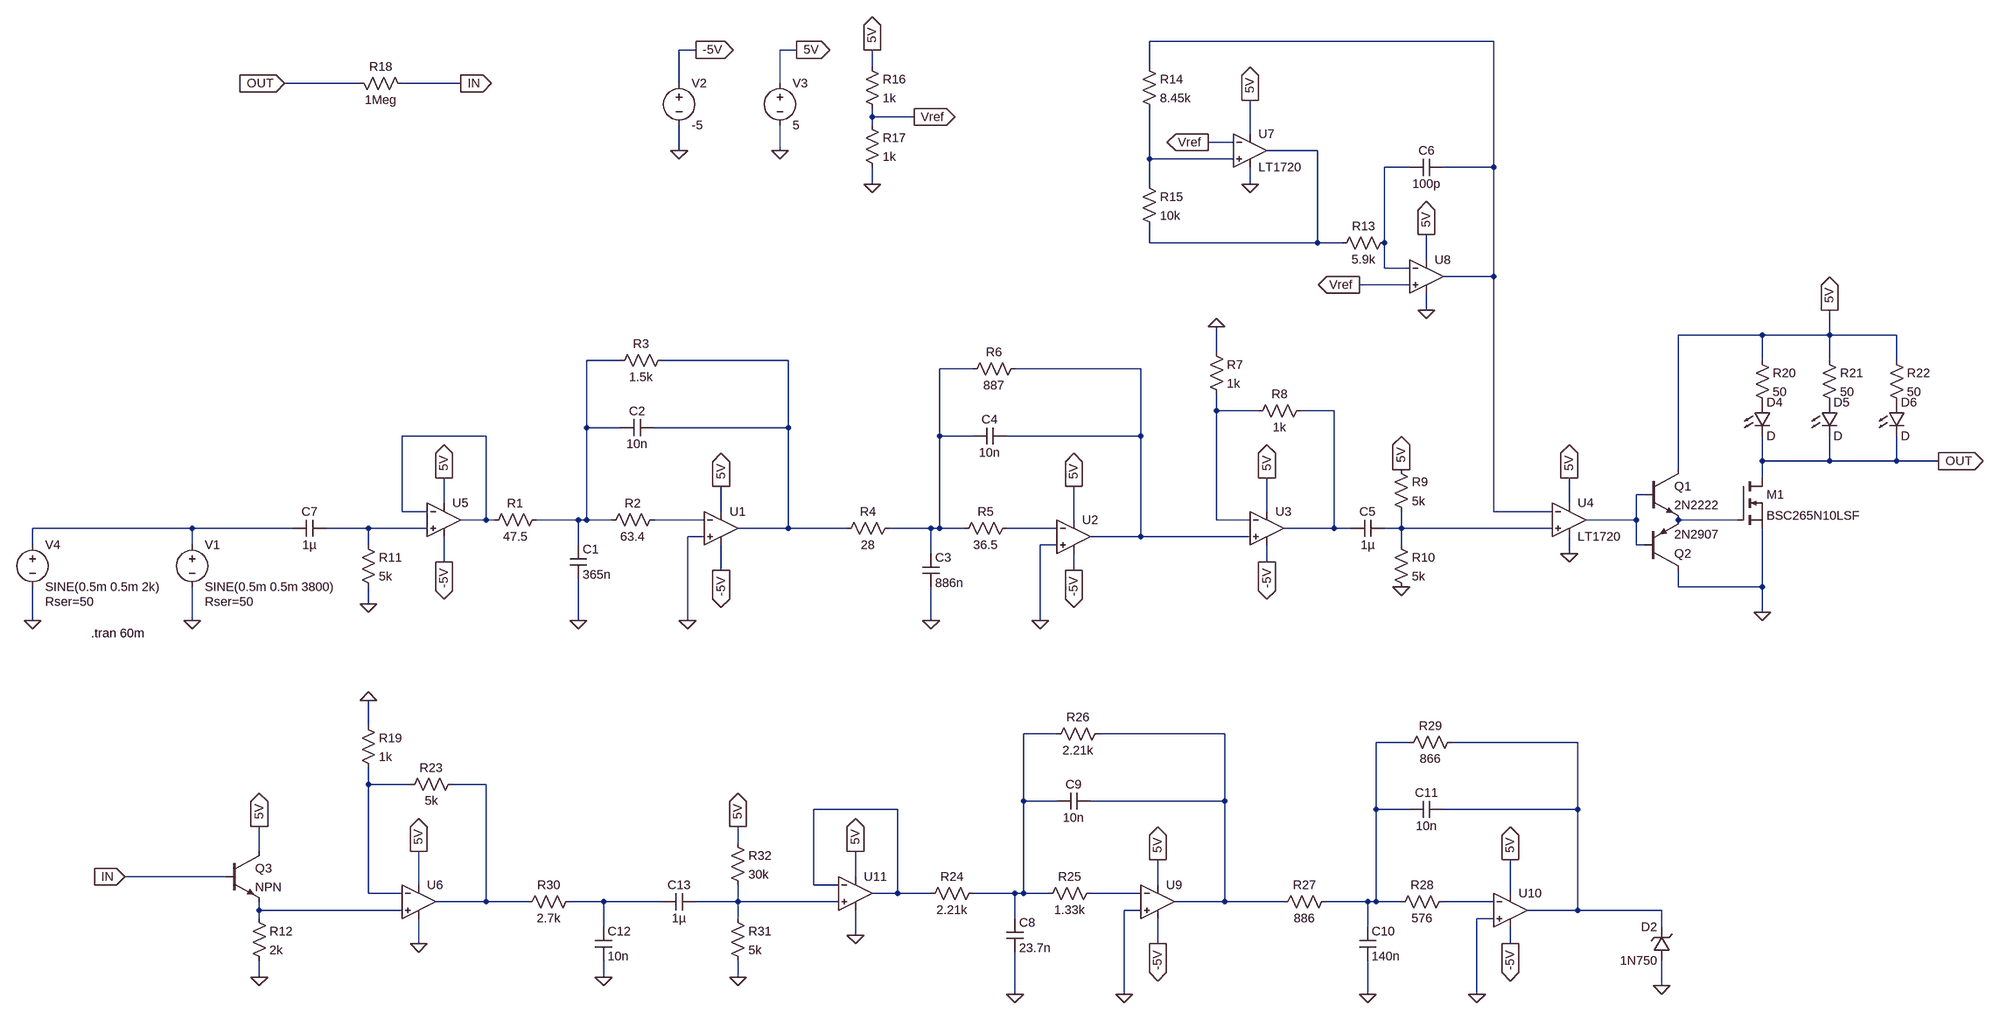
[diagram p0: schematic Filters.asc]
Filters.asc, the LTspice schematic file:
Version 4
SHEET 1 6084 1092
WIRE 2176 -816 1520 -816
WIRE 656 -800 624 -800
WIRE 848 -800 816 -800
WIRE 992 -768 992 -800
WIRE 1520 -768 1520 -816
WIRE 16 -736 -128 -736
WIRE 208 -736 96 -736
WIRE 624 -736 624 -800
WIRE 816 -736 816 -800
WIRE 992 -672 992 -688
WIRE 1072 -672 992 -672
WIRE 992 -656 992 -672
WIRE 1712 -640 1712 -704
WIRE 1680 -624 1632 -624
WIRE 624 -608 624 -656
WIRE 816 -608 816 -656
WIRE 1840 -608 1744 -608
WIRE 1520 -592 1520 -688
WIRE 1680 -592 1520 -592
WIRE 2016 -576 1968 -576
WIRE 2176 -576 2176 -816
WIRE 2176 -576 2080 -576
WIRE 992 -544 992 -576
WIRE 1520 -544 1520 -592
WIRE 1712 -544 1712 -576
WIRE 1520 -432 1520 -464
WIRE 1840 -432 1840 -608
WIRE 1840 -432 1520 -432
WIRE 1888 -432 1840 -432
WIRE 1968 -432 1968 -576
WIRE 2048 -400 2048 -448
WIRE 1968 -384 1968 -432
WIRE 2016 -384 1968 -384
WIRE 2176 -368 2176 -576
WIRE 2176 -368 2080 -368
WIRE 2016 -352 1920 -352
WIRE 2048 -304 2048 -336
WIRE 2688 -256 2528 -256
WIRE 2816 -256 2816 -304
WIRE 2816 -256 2688 -256
WIRE 2944 -256 2816 -256
WIRE 1648 -224 1648 -272
WIRE 512 -208 448 -208
WIRE 832 -208 592 -208
WIRE 2688 -208 2688 -256
WIRE 2816 -208 2816 -256
WIRE 2944 -208 2944 -256
WIRE 1184 -192 1120 -192
WIRE 1504 -192 1264 -192
WIRE 1648 -112 1648 -144
WIRE 1728 -112 1648 -112
WIRE 1872 -112 1808 -112
WIRE 448 -80 448 -208
WIRE 512 -80 448 -80
WIRE 832 -80 832 -208
WIRE 832 -80 576 -80
WIRE 256 -64 96 -64
WIRE 1120 -64 1120 -192
WIRE 1184 -64 1120 -64
WIRE 1504 -64 1504 -192
WIRE 1504 -64 1248 -64
WIRE 2688 -16 2688 -64
WIRE 2816 -16 2816 -64
WIRE 2816 -16 2688 -16
WIRE 2944 -16 2944 -64
WIRE 2944 -16 2816 -16
WIRE 3024 -16 2944 -16
WIRE 2528 0 2528 -256
WIRE 2688 16 2688 -16
WIRE 2464 48 2448 48
WIRE 176 64 176 16
WIRE 2320 64 2320 16
WIRE 96 80 96 -64
WIRE 144 80 96 80
WIRE 704 80 704 32
WIRE 1744 80 1744 16
WIRE 2176 80 2176 -368
WIRE 2288 80 2176 80
WIRE 256 96 256 -64
WIRE 256 96 208 96
WIRE 272 96 256 96
WIRE 432 96 352 96
WIRE 448 96 448 -80
WIRE 448 96 432 96
WIRE 496 96 448 96
WIRE 672 96 576 96
WIRE 1376 96 1376 32
WIRE 1648 96 1648 -112
WIRE 1712 96 1648 96
WIRE 2448 96 2448 48
WIRE 2448 96 2352 96
WIRE 2640 96 2528 96
WIRE -304 112 -608 112
WIRE -112 112 -304 112
WIRE 32 112 -48 112
WIRE 144 112 32 112
WIRE 832 112 832 -80
WIRE 832 112 736 112
WIRE 944 112 832 112
WIRE 1104 112 1024 112
WIRE 1120 112 1120 -64
WIRE 1120 112 1104 112
WIRE 1168 112 1120 112
WIRE 1344 112 1248 112
WIRE 1872 112 1872 -112
WIRE 1872 112 1776 112
WIRE 1904 112 1872 112
WIRE 2000 112 2000 80
WIRE 2000 112 1968 112
WIRE 2288 112 2000 112
WIRE 672 128 640 128
WIRE 1504 128 1504 -64
WIRE 1504 128 1408 128
WIRE 1712 128 1504 128
WIRE -608 144 -608 112
WIRE -304 144 -304 112
WIRE 32 144 32 112
WIRE 432 144 432 96
WIRE 1344 144 1312 144
WIRE 2000 144 2000 112
WIRE 2448 144 2448 96
WIRE 2464 144 2448 144
WIRE 1104 160 1104 112
WIRE 2320 160 2320 128
WIRE 176 176 176 128
WIRE 1744 176 1744 144
WIRE 704 192 704 144
WIRE 1376 192 1376 160
WIRE 2528 224 2528 192
WIRE 2688 224 2688 112
WIRE 2688 224 2528 224
WIRE 32 256 32 224
WIRE 2688 272 2688 224
WIRE -608 288 -608 224
WIRE -304 288 -304 224
WIRE 432 288 432 208
WIRE 640 288 640 128
WIRE 1104 288 1104 224
WIRE 1312 288 1312 144
WIRE 32 528 32 480
WIRE 1344 544 1280 544
WIRE 1664 544 1424 544
WIRE 2016 560 1952 560
WIRE 2336 560 2096 560
WIRE 32 640 32 608
WIRE 112 640 32 640
WIRE 256 640 192 640
WIRE 1280 672 1280 544
WIRE 1344 672 1280 672
WIRE 1664 672 1664 544
WIRE 1664 672 1408 672
WIRE 1040 688 880 688
WIRE 1952 688 1952 560
WIRE 2016 688 1952 688
WIRE 2336 688 2336 560
WIRE 2336 688 2080 688
WIRE 736 752 736 720
WIRE -176 768 -176 720
WIRE -240 816 -432 816
WIRE 960 816 960 768
WIRE 128 832 128 768
WIRE 880 832 880 688
WIRE 928 832 880 832
WIRE 1536 832 1536 784
WIRE 32 848 32 640
WIRE 96 848 32 848
WIRE 1040 848 1040 688
WIRE 1040 848 992 848
WIRE 1104 848 1040 848
WIRE 1264 848 1184 848
WIRE 1280 848 1280 672
WIRE 1280 848 1264 848
WIRE 1328 848 1280 848
WIRE 1504 848 1408 848
WIRE 2208 848 2208 784
WIRE 256 864 256 640
WIRE 256 864 160 864
WIRE 336 864 256 864
WIRE 480 864 416 864
WIRE 592 864 480 864
WIRE 736 864 736 832
WIRE 736 864 656 864
WIRE 928 864 736 864
WIRE 1664 864 1664 672
WIRE 1664 864 1568 864
WIRE 1776 864 1664 864
WIRE 1936 864 1856 864
WIRE 1952 864 1952 688
WIRE 1952 864 1936 864
WIRE 2000 864 1952 864
WIRE 2176 864 2080 864
WIRE -176 880 -176 864
WIRE 96 880 -176 880
WIRE 1504 880 1472 880
WIRE 2336 880 2336 688
WIRE 2336 880 2240 880
WIRE 2496 880 2336 880
WIRE -176 896 -176 880
WIRE 736 896 736 864
WIRE 1264 896 1264 848
WIRE 2176 896 2144 896
WIRE 480 912 480 864
WIRE 1936 912 1936 864
WIRE 2496 912 2496 880
WIRE 960 928 960 880
WIRE 128 944 128 896
WIRE 1536 944 1536 896
WIRE 2208 944 2208 912
WIRE -176 1008 -176 976
WIRE 480 1008 480 976
WIRE 736 1008 736 976
WIRE 2496 1024 2496 976
WIRE 1264 1040 1264 960
WIRE 1472 1040 1472 880
WIRE 1936 1040 1936 976
WIRE 2144 1040 2144 896
FLAG 624 -608 0
FLAG 816 -608 0
FLAG 848 -800 5V
IOPIN 848 -800 Out
FLAG 656 -800 -5V
IOPIN 656 -800 Out
FLAG -304 288 0
FLAG 432 288 0
FLAG 640 288 0
FLAG 1104 288 0
FLAG 1312 288 0
FLAG 704 32 5V
IOPIN 704 32 Out
FLAG 1376 32 5V
IOPIN 1376 32 Out
FLAG 704 192 -5V
IOPIN 704 192 Out
FLAG 1376 192 -5V
IOPIN 1376 192 Out
FLAG 1744 16 5V
IOPIN 1744 16 Out
FLAG 1744 176 -5V
IOPIN 1744 176 Out
FLAG 1648 -272 0
FLAG 2000 0 5V
IOPIN 2000 0 Out
FLAG 2000 224 0
FLAG 2320 16 5V
IOPIN 2320 16 Out
FLAG 2320 160 0
FLAG 2048 -448 5V
IOPIN 2048 -448 Out
FLAG 2048 -304 0
FLAG 1712 -704 5V
IOPIN 1712 -704 Out
FLAG 1712 -544 0
FLAG 2688 272 0
FLAG 2816 -304 5V
IOPIN 2816 -304 Out
FLAG 992 -800 5V
IOPIN 992 -800 Out
FLAG 992 -544 0
FLAG 1072 -672 Vref
IOPIN 1072 -672 Out
FLAG 1632 -624 Vref
IOPIN 1632 -624 Out
FLAG 1920 -352 Vref
IOPIN 1920 -352 Out
FLAG 176 16 5V
IOPIN 176 16 Out
FLAG 176 176 -5V
IOPIN 176 176 Out
FLAG 32 256 0
FLAG -176 720 5V
IOPIN -176 720 Out
FLAG -176 1008 0
FLAG 128 768 5V
IOPIN 128 768 Out
FLAG 32 480 0
FLAG 128 944 0
FLAG 480 1008 0
FLAG 1264 1040 0
FLAG 1472 1040 0
FLAG 1936 1040 0
FLAG 2144 1040 0
FLAG 1536 784 5V
IOPIN 1536 784 Out
FLAG 2208 784 5V
IOPIN 2208 784 Out
FLAG 1536 944 -5V
IOPIN 1536 944 Out
FLAG 2208 944 -5V
IOPIN 2208 944 Out
FLAG 960 768 5V
IOPIN 960 768 Out
FLAG 960 928 0
FLAG 2496 1024 0
FLAG -608 288 0
FLAG 3024 -16 OUT
IOPIN 3024 -16 Out
FLAG -128 -736 OUT
IOPIN -128 -736 In
FLAG 208 -736 IN
IOPIN 208 -736 Out
FLAG -432 816 IN
IOPIN -432 816 In
FLAG 736 1008 0
FLAG 736 720 5V
IOPIN 736 720 Out
SYMBOL voltage -304 128 R0
WINDOW 123 0 0 Left 0
WINDOW 39 24 124 Left 2
SYMATTR SpiceLine Rser=50
SYMATTR InstName V1
SYMATTR Value SINE(0.5m 0.5m 3800)
SYMBOL voltage 624 -752 R0
WINDOW 123 0 0 Left 0
WINDOW 39 0 0 Left 0
SYMATTR InstName V2
SYMATTR Value -5
SYMBOL voltage 816 -752 R0
WINDOW 123 0 0 Left 0
WINDOW 39 0 0 Left 0
SYMATTR InstName V3
SYMATTR Value 5
SYMBOL res 368 80 R90
WINDOW 0 0 56 VBottom 2
WINDOW 3 32 56 VTop 2
SYMATTR InstName R1
SYMATTR Value 47.5
SYMBOL res 592 80 R90
WINDOW 0 0 56 VBottom 2
WINDOW 3 32 56 VTop 2
SYMATTR InstName R2
SYMATTR Value 63.4
SYMBOL res 608 -224 R90
WINDOW 0 0 56 VBottom 2
WINDOW 3 32 56 VTop 2
SYMATTR InstName R3
SYMATTR Value 1.5k
SYMBOL cap 416 144 R0
SYMATTR InstName C1
SYMATTR Value 365n
SYMBOL cap 576 -96 R90
WINDOW 0 0 32 VBottom 2
WINDOW 3 32 32 VTop 2
SYMATTR InstName C2
SYMATTR Value 10n
SYMBOL res 1040 96 R90
WINDOW 0 0 56 VBottom 2
WINDOW 3 32 56 VTop 2
SYMATTR InstName R4
SYMATTR Value 28
SYMBOL res 1264 96 R90
WINDOW 0 0 56 VBottom 2
WINDOW 3 32 56 VTop 2
SYMATTR InstName R5
SYMATTR Value 36.5
SYMBOL res 1280 -208 R90
WINDOW 0 0 56 VBottom 2
WINDOW 3 32 56 VTop 2
SYMATTR InstName R6
SYMATTR Value 887
SYMBOL cap 1088 160 R0
SYMATTR InstName C3
SYMATTR Value 886n
SYMBOL cap 1248 -80 R90
WINDOW 0 0 32 VBottom 2
WINDOW 3 32 32 VTop 2
SYMATTR InstName C4
SYMATTR Value 10n
SYMBOL Opamps\\UniversalOpamp2 704 112 R0
SYMATTR InstName U1
SYMBOL Opamps\\UniversalOpamp2 1376 128 R0
SYMATTR InstName U2
SYMBOL Opamps\\UniversalOpamp2 1744 112 R0
SYMATTR InstName U3
SYMBOL res 1632 -240 R0
SYMATTR InstName R7
SYMATTR Value 1k
SYMBOL res 1824 -128 R90
WINDOW 0 0 56 VBottom 2
WINDOW 3 32 56 VTop 2
SYMATTR InstName R8
SYMATTR Value 1k
SYMBOL res 1984 -16 R0
SYMATTR InstName R9
SYMATTR Value 5k
SYMBOL res 1984 128 R0
SYMATTR InstName R10
SYMATTR Value 5k
SYMBOL cap 1968 96 R90
WINDOW 0 0 32 VBottom 2
WINDOW 3 32 32 VTop 2
SYMATTR InstName C5
SYMATTR Value 1µ
SYMBOL Comparators\\LT1720 2320 32 R0
SYMATTR InstName U4
SYMBOL cap 2080 -592 R90
WINDOW 0 0 32 VBottom 2
WINDOW 3 32 32 VTop 2
SYMATTR InstName C6
SYMATTR Value 100p
SYMBOL res 1984 -448 R90
WINDOW 0 0 56 VBottom 2
WINDOW 3 32 56 VTop 2
SYMATTR InstName R13
SYMATTR Value 5.9k
SYMBOL res 1504 -784 R0
SYMATTR InstName R14
SYMATTR Value 8.45k
SYMBOL res 1504 -560 R0
SYMATTR InstName R15
SYMATTR Value 10k
SYMBOL Comparators\\LT1720 1712 -672 R0
SYMATTR InstName U7
SYMBOL Opamps\\UniversalOpamp2 2048 -368 R0
SYMATTR InstName U8
SYMBOL nmos 2640 16 R0
SYMATTR InstName M1
SYMATTR Value BSC265N10LSF
SYMBOL res 2672 -224 R0
SYMATTR InstName R20
SYMATTR Value 50
SYMBOL res 2800 -224 R0
SYMATTR InstName R21
SYMATTR Value 50
SYMBOL res 2928 -224 R0
SYMATTR InstName R22
SYMATTR Value 50
SYMBOL LED 2672 -128 R0
SYMATTR InstName D4
SYMBOL LED 2800 -128 R0
SYMATTR InstName D5
SYMBOL LED 2928 -128 R0
SYMATTR InstName D6
SYMBOL npn 2464 0 R0
SYMATTR InstName Q1
SYMATTR Value 2N2222
SYMBOL pnp 2464 192 M180
SYMATTR InstName Q2
SYMATTR Value 2N2907
SYMBOL res 976 -784 R0
SYMATTR InstName R16
SYMATTR Value 1k
SYMBOL res 976 -672 R0
SYMATTR InstName R17
SYMATTR Value 1k
SYMBOL Opamps\\UniversalOpamp2 176 96 R0
SYMATTR InstName U5
SYMBOL cap -48 96 R90
WINDOW 0 0 32 VBottom 2
WINDOW 3 32 32 VTop 2
SYMATTR InstName C7
SYMATTR Value 1µ
SYMBOL res 16 128 R0
SYMATTR InstName R11
SYMATTR Value 5k
SYMBOL npn -240 768 R0
SYMATTR InstName Q3
SYMBOL res -192 880 R0
SYMATTR InstName R12
SYMATTR Value 2k
SYMBOL res 0 -752 M90
WINDOW 0 0 56 VBottom 2
WINDOW 3 32 56 VTop 2
SYMATTR InstName R18
SYMATTR Value 1Meg
SYMBOL Opamps\\UniversalOpamp2 128 864 R0
SYMATTR InstName U6
SYMBOL res 16 512 R0
SYMATTR InstName R19
SYMATTR Value 1k
SYMBOL res 208 624 R90
WINDOW 0 0 56 VBottom 2
WINDOW 3 32 56 VTop 2
SYMATTR InstName R23
SYMATTR Value 5k
SYMBOL res 432 848 R90
WINDOW 0 0 56 VBottom 2
WINDOW 3 32 56 VTop 2
SYMATTR InstName R30
SYMATTR Value 2.7k
SYMBOL cap 464 912 R0
SYMATTR InstName C12
SYMATTR Value 10n
SYMBOL res 1200 832 R90
WINDOW 0 0 56 VBottom 2
WINDOW 3 32 56 VTop 2
SYMATTR InstName R24
SYMATTR Value 2.21k
SYMBOL res 1424 832 R90
WINDOW 0 0 56 VBottom 2
WINDOW 3 32 56 VTop 2
SYMATTR InstName R25
SYMATTR Value 1.33k
SYMBOL res 1440 528 R90
WINDOW 0 0 56 VBottom 2
WINDOW 3 32 56 VTop 2
SYMATTR InstName R26
SYMATTR Value 2.21k
SYMBOL cap 1248 896 R0
SYMATTR InstName C8
SYMATTR Value 23.7n
SYMBOL cap 1408 656 R90
WINDOW 0 0 32 VBottom 2
WINDOW 3 32 32 VTop 2
SYMATTR InstName C9
SYMATTR Value 10n
SYMBOL res 1872 848 R90
WINDOW 0 0 56 VBottom 2
WINDOW 3 32 56 VTop 2
SYMATTR InstName R27
SYMATTR Value 886
SYMBOL res 2096 848 R90
WINDOW 0 0 56 VBottom 2
WINDOW 3 32 56 VTop 2
SYMATTR InstName R28
SYMATTR Value 576
SYMBOL res 2112 544 R90
WINDOW 0 0 56 VBottom 2
WINDOW 3 32 56 VTop 2
SYMATTR InstName R29
SYMATTR Value 866
SYMBOL cap 1920 912 R0
SYMATTR InstName C10
SYMATTR Value 140n
SYMBOL cap 2080 672 R90
WINDOW 0 0 32 VBottom 2
WINDOW 3 32 32 VTop 2
SYMATTR InstName C11
SYMATTR Value 10n
SYMBOL Opamps\\UniversalOpamp2 1536 864 R0
SYMATTR InstName U9
SYMBOL Opamps\\UniversalOpamp2 2208 880 R0
SYMATTR InstName U10
SYMBOL Opamps\\UniversalOpamp2 960 848 R0
SYMATTR InstName U11
SYMBOL zener 2512 976 R180
WINDOW 0 24 64 Left 2
WINDOW 3 24 0 Left 2
SYMATTR InstName D2
SYMATTR Value 1N750
SYMBOL voltage -608 128 R0
WINDOW 123 0 0 Left 0
WINDOW 39 24 124 Left 2
SYMATTR SpiceLine Rser=50
SYMATTR InstName V4
SYMATTR Value SINE(0.5m 0.5m 2k)
SYMBOL cap 656 848 R90
WINDOW 0 0 32 VBottom 2
WINDOW 3 32 32 VTop 2
SYMATTR InstName C13
SYMATTR Value 1µ
SYMBOL res 720 880 R0
SYMATTR InstName R31
SYMATTR Value 5k
SYMBOL res 720 736 R0
SYMATTR InstName R32
SYMATTR Value 30k
TEXT -496 312 Left 2 !.tran 60m

The netlist it stands for:
* Filters.asc
V1 N015 0 SINE(0.5m 0.5m 3800) Rser=50
V2 -5V 0 -5
V3 5V 0 5
R1 N005 N011 47.5
R2 N013 N005 63.4
R3 N006 N005 1.5k
C1 N005 0 365n
C2 N006 N005 10n
R4 N007 N006 28
R5 N017 N007 36.5
R6 N008 N007 887
C3 N007 0 886n
C4 N008 N007 10n
XU1 0 N013 5V -5V N006 level.2 Avol=1Meg GBW=10Meg Slew=10Meg ilimit=25m rail=0 Vos=0 phimargin=45 en=0 enk=0 in=0 ink=0 Rin=500Meg  ; pins IN+ IN- V+ V- OUT
XU2 0 N017 5V -5V N008 level.2 Avol=1Meg GBW=10Meg Slew=10Meg ilimit=25m rail=0 Vos=0 phimargin=45 en=0 enk=0 in=0 ink=0 Rin=500Meg  ; pins IN+ IN- V+ V- OUT
XU3 N008 N009 5V -5V N010 level.2 Avol=1Meg GBW=10Meg Slew=10Meg ilimit=25m rail=0 Vos=0 phimargin=45 en=0 enk=0 in=0 ink=0 Rin=500Meg  ; pins IN+ IN- V+ V- OUT
R7 0 N009 1k
R8 N010 N009 1k
R9 5V N018 5k
R10 N018 0 5k
C5 N018 N010 1µ
XU4 N018 N001 5V 0 N012 LT1720  ; pins In+ In- V+ V- OUT
C6 N001 N004 100p
R13 N004 N002 5.9k
R14 N001 N003 8.45k
R15 N003 N002 10k
XU7 N003 Vref 5V 0 N002 LT1720  ; pins In+ In- V+ V- OUT
XU8 Vref N004 5V 0 N001 level.2 Avol=1Meg GBW=10Meg Slew=10Meg ilimit=25m rail=0 Vos=0 phimargin=45 en=0 enk=0 in=0 ink=0 Rin=500Meg  ; pins IN+ IN- V+ V- OUT
M1 OUT N014 0 0 BSC265N10LSF
R20 5V P001 50
R21 5V P002 50
R22 5V P003 50
D4 P001 OUT D
D5 P002 OUT D
D6 P003 OUT D
Q1 5V N012 N014 0 2N2222
Q2 0 N012 N014 0 2N2907
R16 5V Vref 1k
R17 Vref 0 1k
XU5 N016 N011 5V -5V N011 level.2 Avol=1Meg GBW=10Meg Slew=10Meg ilimit=25m rail=0 Vos=0 phimargin=45 en=0 enk=0 in=0 ink=0 Rin=500Meg  ; pins IN+ IN- V+ V- OUT
C7 N016 N015 1µ
R11 N016 0 5k
Q3 5V IN N030 0 NPN
R12 N030 0 2k
R18 OUT IN 1Meg
XU6 N030 N023 5V 0 N024 level.2 Avol=1Meg GBW=10Meg Slew=10Meg ilimit=25m rail=0 Vos=0 phimargin=45 en=0 enk=0 in=0 ink=0 Rin=500Meg  ; pins IN+ IN- V+ V- OUT
R19 0 N023 1k
R23 N024 N023 5k
R30 N027 N024 2.7k
C12 N027 0 10n
R24 N019 N025 2.21k
R25 N026 N019 1.33k
R26 N020 N019 2.21k
C8 N019 0 23.7n
C9 N020 N019 10n
R27 N021 N020 886
R28 N029 N021 576
R29 N022 N021 866
C10 N021 0 140n
C11 N022 N021 10n
XU9 0 N026 5V -5V N020 level.2 Avol=1Meg GBW=10Meg Slew=10Meg ilimit=25m rail=0 Vos=0 phimargin=45 en=0 enk=0 in=0 ink=0 Rin=500Meg  ; pins IN+ IN- V+ V- OUT
XU10 0 N029 5V -5V N022 level.2 Avol=1Meg GBW=10Meg Slew=10Meg ilimit=25m rail=0 Vos=0 phimargin=45 en=0 enk=0 in=0 ink=0 Rin=500Meg  ; pins IN+ IN- V+ V- OUT
XU11 N028 N025 5V 0 N025 level.2 Avol=1Meg GBW=10Meg Slew=10Meg ilimit=25m rail=0 Vos=0 phimargin=45 en=0 enk=0 in=0 ink=0 Rin=500Meg  ; pins IN+ IN- V+ V- OUT
D2 0 N022 1N750
V4 N015 0 SINE(0.5m 0.5m 2k) Rser=50
C13 N028 N027 1µ
R31 N028 0 5k
R32 5V N028 30k
.model D D
.lib standard.dio
.model NPN NPN
.model PNP PNP
.lib standard.bjt
.model NMOS NMOS
.model PMOS PMOS
.lib standard.mos
.tran 60m
.lib UniversalOpamps2.sub
.lib LT1720.sub
.backanno
.end